# EAGLE schematic FiberLink_RS232 (EAGLE 6.4)
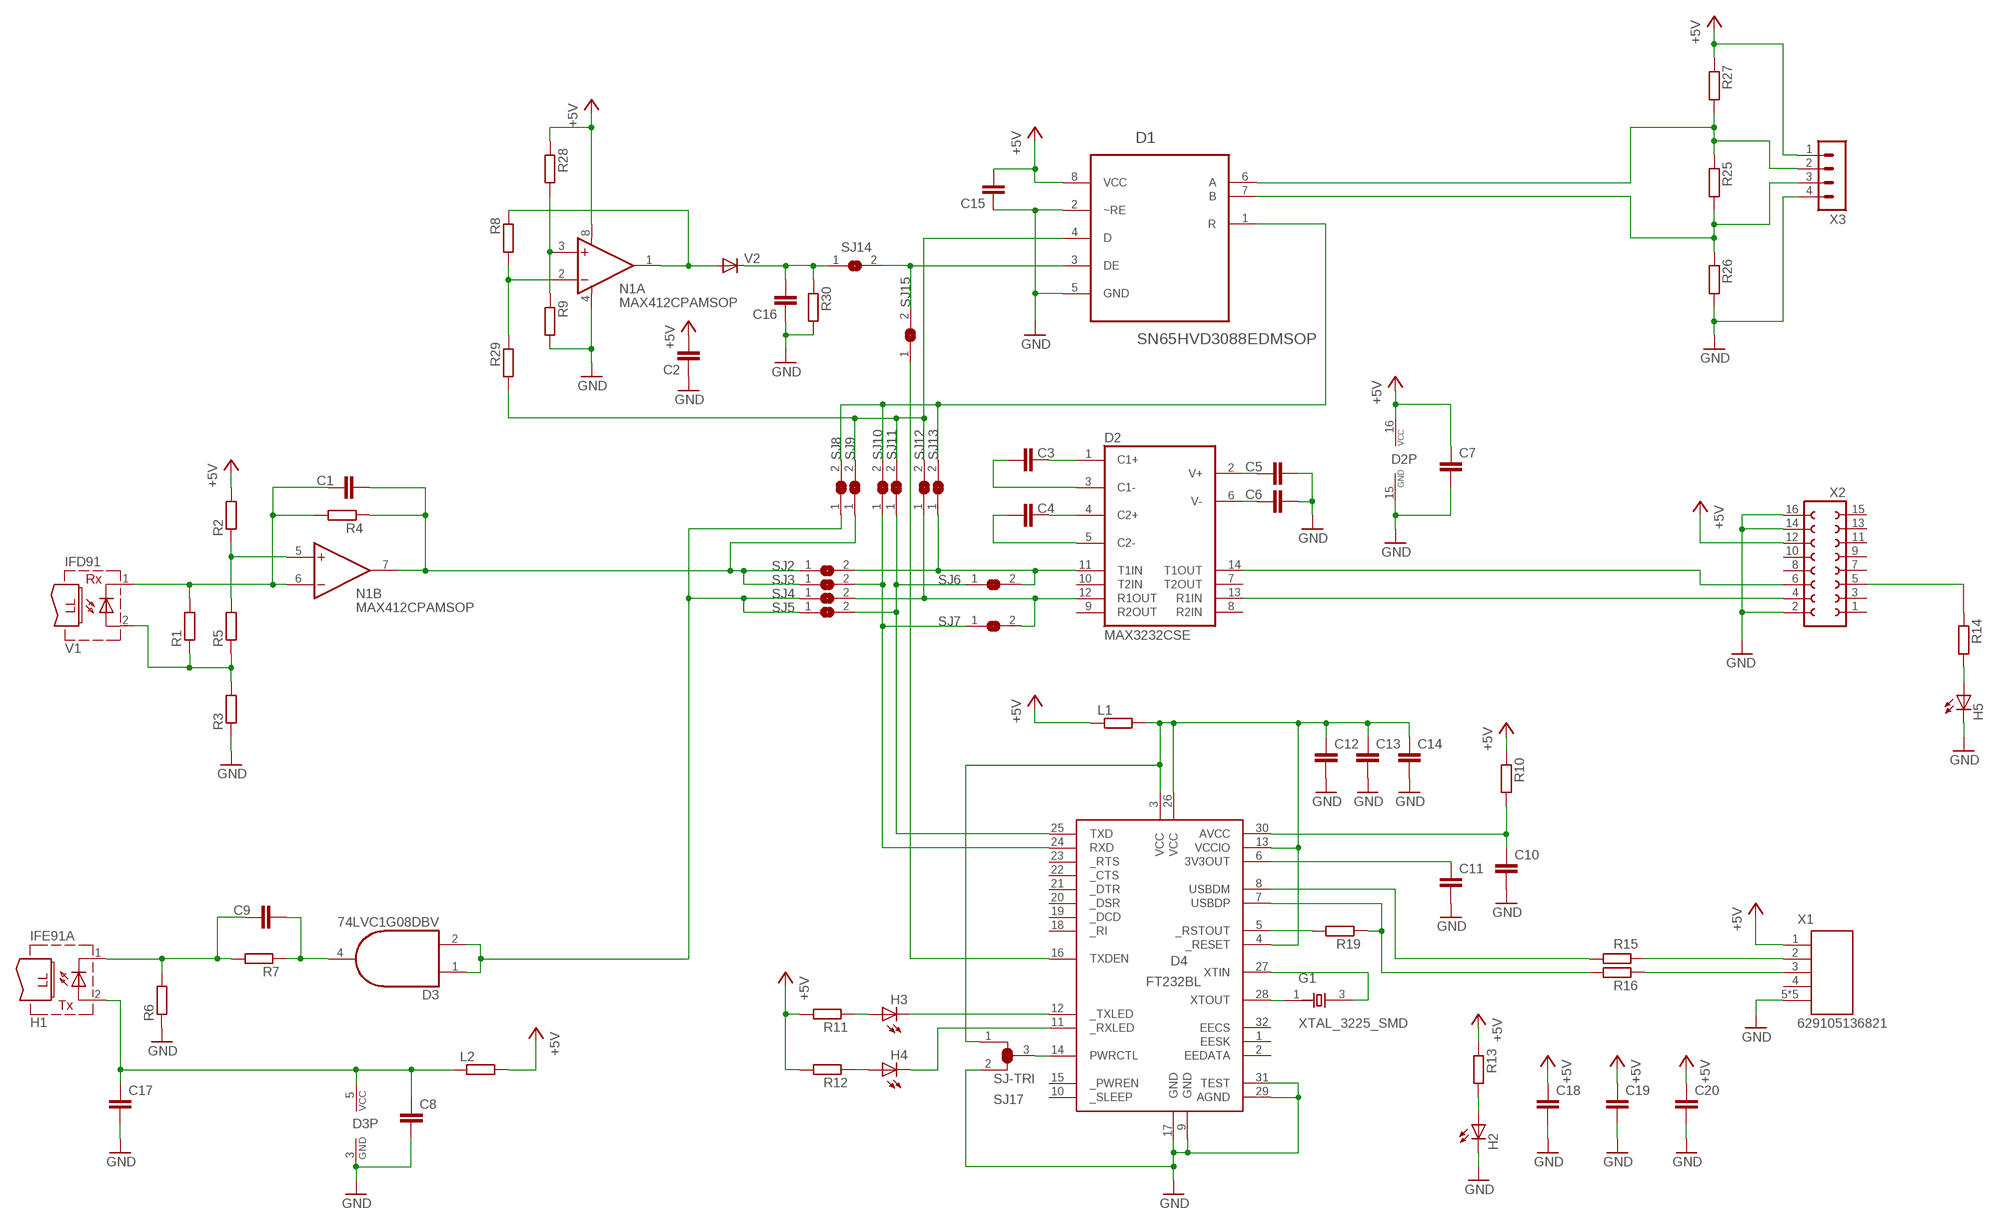
[diagram p0: schematic, sheet 1]

## Parts
C1  C-EUC0402  [C0402]
C2  C-EUC0402  [C0402]
C3  C-EUC0402  [C0402]
C4  C-EUC0402  [C0402]
C5  C-EUC0402  [C0402]
C6  C-EUC0402  [C0402]
C7  C-EUC0402  [C0402]
C8  C-EUC0402  [C0402]
C9  C-EUC0402  [C0402]
C10  C-EUC0402  [C0402]
C11  C-EUC0402  [C0402]
C12  C-EUC0402  [C0402]
C13  C-EUC0402  [C0402]
C14  C-EUC0402  [C0402]
C15  C-EUC0402  [C0402]
C16  C-EUC0402  [C0402]
C17  C-EUC0402  [C0402]
C18  C-EUC0805  [C0805]
C19  C-EUC0805  [C0805]
C20  C-EUC0805  [C0805]
D1  SN65HVD3088EDMSOP  [SOP65P490X110-8N]
D2  MAX3232CSE  [SO16]
D3  74LVC1G08DBV  [SOT23-5]
D4  FT232BL  [LQFP32]
G1  XTAL_3225_SMD  [X_3225]
H1  IFE91A  [IFO-IFX]
H2  LEDCHIP-LED0603  [CHIP-LED0603]
H3  LEDCHIP-LED0603  [CHIP-LED0603]
H4  LEDCHIP-LED0603  [CHIP-LED0603]
H5  LEDCHIP-LED0603  [CHIP-LED0603]
L1  R-EU_R0402  [R0402_VISHAY]
L2  R-EU_R0402  [R0402_VISHAY]
N1  MAX412CPAMSOP  [SOP65P490X110-8N]
R1  R-EU_R0402  [R0402_VISHAY]
R2  R-EU_R0402  [R0402_VISHAY]
R3  R-EU_R0402  [R0402_VISHAY]
R4  R-EU_R0402  [R0402_VISHAY]
R5  R-EU_R0402  [R0402_VISHAY]
R6  R-EU_R1206  [R1206]
R7  R-EU_R1206  [R1206]
R8  R-EU_R0402  [R0402_VISHAY]
R9  R-EU_R0402  [R0402_VISHAY]
R10  R-EU_R0402  [R0402_VISHAY]
R11  R-EU_R0402  [R0402_VISHAY]
R12  R-EU_R0402  [R0402_VISHAY]
R13  R-EU_R0402  [R0402_VISHAY]
R14  R-EU_R0402  [R0402_VISHAY]
R15  R-EU_R0402  [R0402_VISHAY]
R16  R-EU_R0402  [R0402_VISHAY]
R19  R-EU_R0402  [R0402_VISHAY]
R25  R-EU_R1206  [R1206]
R26  R-EU_R0603  [R0603]
R27  R-EU_R0603  [R0603]
R28  R-EU_R0402  [R0402_VISHAY]
R29  R-EU_R0402  [R0402_VISHAY]
R30  R-EU_R0402  [R0402_VISHAY]
SJ2  SJ  [SJ-SMALL]
SJ3  SJ  [SJ-SMALL]
SJ4  SJ  [SJ-SMALL]
SJ5  SJ  [SJ-SMALL]
SJ6  SJ  [SJ-SMALL]
SJ7  SJ  [SJ-SMALL]
SJ8  SJ  [SJ-SMALL]
SJ9  SJ  [SJ-SMALL]
SJ10  SJ  [SJ-SMALL]
SJ11  SJ  [SJ-SMALL]
SJ12  SJ  [SJ-SMALL]
SJ13  SJ  [SJ-SMALL]
SJ14  SJ  [SJ-SMALL]
SJ15  SJ  [SJ-SMALL]
SJ17  SJ-TRI  [SJ-SMALL-TRI]
V1  IFD91  [IFO-IFX]
V2  DIODE-SOD323-R  [SOD323-R]
X1  629105136821  [629105136821]
X2  FE08-2  [FE08-2]
X3  MA04-1  [MA04-1]

## Nets
485_HIGH: D1.6(A) R25.1 R27.2 X3.2
485_LOW: D1.7(B) R25.2 R26.1 X3.3
+5V: C2.2 C7.1 C15.2 C18.1 C19.1 C20.1 D1.8(VCC) D2.16(VCC) L1.1 L2.2 N1.8(A:V+) R2.2 R10.1 R11.2 R12.2 R13.1 R27.1 R28.1 X1.1 X2.12 X3.1
AVCC: C10.1 D4.30(AVCC) R10.2
CARRIER_SENSE: C16.2 R30.1 SJ14.1 V2.C
FPGADONE: R14.1 X2.5
G1: D4.27(XTIN) G1.3(X2)
GND: C2.1 C5.2 C6.2 C7.2 C8.2 C10.2 C11.2 C12.2 C13.2 C14.2 C15.1 C16.1 C17.2 C18.2 C19.2 C20.2 D1.2(~RE) D1.5(GND) D2.15(GND) D3.3(GND) D4.9(GND) D4.17(GND) D4.29(AGND) D4.31(TEST) H2.C H5.C N1.4(A:V-) R3.1 R6.1 R9.2 R26.2 R30.2 SJ17.2 X1.5 X1.Z1 X1.Z2 X1.Z3 X1.Z4 X2.2 X2.14 X2.16 X3.4
N$1: C1.1 N1.6(B:-IN) R1.2 R4.2 V1.1(C)
N$2: N1.1(A:OUT) R8.1 V2.A
N$3: R1.1 R3.2 R5.1 V1.2(A)
N$4: D4.12(_TXLED) H3.C
N$5: N1.5(B:+IN) R2.1 R5.2
N$6: C4.2 D2.5(C2-)
N$7: C4.1 D2.4(C2+)
N$8: C3.2 D2.3(C1-)
N$9: C3.1 D2.1(C1+)
N$10: C6.1 D2.6(V-)
N$11: C5.1 D2.2(V+)
N$12: D2.14(T1OUT) X2.6
N$13: D2.13(R1IN) X2.4
N$14: D4.11(_RXLED) H4.C
N$15: C9.1 H1.1(C) R6.2 R7.2
N$16: N1.3(A:+IN) R9.1 R28.2
N$17: C9.2 D3.4(O) R7.1
N$18: H3.A R11.1
N$19: R15.1 X1.2
N$20: H4.A R12.1
N$21: D4.8(USBDM) R15.2
N$22: H2.A R13.2
N$23: D4.7(USBDP) R16.2 R19.1
N$24: R16.1 X1.3
N$25: H5.A R14.2
N$26: D4.14(PWRCTL) SJ17.3
N$29: D4.5(_RSTOUT) R19.2
N$32: N1.2(A:-IN) R8.2 R29.1
N$33: D4.28(XTOUT) G1.1(X1)
RXD_232: D2.12(R1OUT) SJ4.2 SJ7.2 SJ12.1
RXD_485: D1.1(R) SJ8.2 SJ10.2 SJ13.2
RXD_FIBER: C1.2 N1.7(B:OUT) R4.1 SJ2.1 SJ3.1 SJ9.1
RXD_USB: D4.24(RXD) SJ3.2 SJ7.1 SJ10.1
TX_VCC: C8.1 C17.1 D3.5(VCC) H1.2(A) L2.1
TXD_232: D2.11(T1IN) SJ2.2 SJ6.2 SJ13.1
TXD_485: D1.4(D) R29.2 SJ9.2 SJ11.2 SJ12.2
TXD_FIBER: D3.1(I0) D3.2(I1) SJ4.1 SJ5.1 SJ8.1
TXD_USB: D4.25(TXD) SJ5.2 SJ6.1 SJ11.1
TXEN_485: D1.3(DE) SJ14.2 SJ15.2
TXEN_USB: D4.16(TXDEN) SJ15.1
USB3V3: C11.1 D4.6(3V3OUT)
USBVCC: C12.1 C13.1 C14.1 D4.3(VCC) D4.4(_RESET) D4.13(VCCIO) D4.26(VCC) L1.2 SJ17.1
Unconnected: D2.7(T2OUT) D2.8(R2IN) D2.9(R2OUT) D2.10(T2IN) D4.1(EESK) D4.2(EEDATA) D4.10(_SLEEP) D4.15(_PWREN) D4.18(_RI) D4.19(_DCD) D4.20(_DSR) D4.21(_DTR) D4.22(_CTS) D4.23(_RTS) D4.32(EECS) X1.4 X2.1 X2.3 X2.7 X2.8 X2.9 X2.10 X2.11 X2.13 X2.15

## Library data of the parts
C1-C20 = rcl:C-EU: CAPACITOR, European symbol
D1 = OMAT_IC:SN65HVD3088ED: Low-Power RS-485 Transceivers, Available in a Small MSOP-8 Package
D2 = maxim:MAX3232*: True RS-232 Transceivers 3.0V to 5.5V, Low-Power up to 1Mbps, Using Four 0.1µF External Capacitors Source: http://pdfserv.maxim-ic.com/en/ds/MAX3222-MAX3241.pdf; MPN: MAX3232CSE; OC_FARNELL: 9725490; OC_NEWARK: 90C2890
D3 = 74xx-little-us:74*1G08: 2-input AND gate
D4 = ftdichip-3:FT232BL: USB UART 2nd Generation USB UART (USB <-> Serial) Controller
G1 = OMAT_IC:XTAL_3225_SMD: CRYSTAL CLOCK OSCILLATORS 5.0 Vdc or 3.3 Vdc - LOW PROFILE ULTRA MINIATURE CERAMIC SURFACE MOUNT Source: http://www.abracon.com/Oscillators/asf1-L-L1.pdf
H1 = OMAT_IC:IFE91A
H2-H5 = OMAT_IC:LED: LED OSRAM: - CHIPLED LG R971, LG N971, LY N971, LG Q971, LY Q971, LO R971, LY R971 LH N974, LH R974 LS Q976, LO Q976, LY Q976 LO Q996 - Hyper CHIPLED LW Q18S LB Q993, LB Q99A, LB R99A - SideLED LS A670, LO A670, LY A670, LG A670, LP A670 LB A673, LV A673, LT A673, LW A673 LH A674 LY A675 LS A676, LA A676, LO A676, LY A676, LW A676 LS A679, LY A679, LG A679 - Hyper Micro SIDELED® LS Y876, LA Y876, LO Y876, LY Y876 LT Y87S - SmartLED LW L88C, LW L88S LB L89C, LB L89S, LG L890 LS L89K, LO L89K, LY L89K LS L896, LA L896, LO L896, LY L896 - TOPLED LS T670, LO T670, LY T670, LG T670, LP T670 LSG T670, LSP T670, LSY T670, LOP T670, LYG T670 LG T671, LOG T671, LSG T671 LB T673, LV T673, LT T673, LW T673 LH T674 LS T676, LA T676, LO T676, LY T676, LB T676, LH T676, LSB T676, LW T676 LB T67C, LV T67C, LT T67C, LS T67K, LO T67K, LY T67K, LW E67C LS E67B, LA E67B, LO E67B, LY E67B, LB E67C, LV E67C, LT E67C LW T67C LS T679, LY T679, LG T679 LS T770, LO T770, LY T770, LG T770, LP T770 LB T773, LV T773, LT T773, LW T773 LH T774 LS E675, LA E675, LY E675, LS T675 LS T776, LA T776, LO T776, LY T776, LB T776 LHGB T686 LT T68C, LB T68C - Hyper Mini TOPLED® LB M676 - Mini TOPLED Santana® LG M470 LS M47K, LO M47K, LY M47K Source: http://www.osram.convergy.de LUXEON: - LUMILED® LXK2-PW12-R00, LXK2-PW12-S00, LXK2-PW14-U00, LXK2-PW14-V00 LXK2-PM12-R00, LXK2-PM12-S00, LXK2-PM14-U00 LXK2-PE12-Q00, LXK2-PE12-R00, LXK2-PE12-S00, LXK2-PE14-T00, LXK2-PE14-U00 LXK2-PB12-K00, LXK2-PB12-L00, LXK2-PB12-M00, LXK2-PB14-N00, LXK2-PB14-P00, LXK2-PB14-Q00 LXK2-PR12-L00, LXK2-PR12-M00, LXK2-PR14-Q00, LXK2-PR14-R00 LXK2-PD12-Q00, LXK2-PD12-R00, LXK2-PD12-S00 LXK2-PH12-R00, LXK2-PH12-S00 LXK2-PL12-P00, LXK2-PL12-Q00, LXK2-PL12-R00 Source: www.luxeon.com KINGBRIGHT: KA-3528ASYC Source: www.kingbright.com
L1 L2 R1-R16 R19 R25-R30 = rcl:R-EU_: RESISTOR, European symbol
N1 = OMAT_IC:MAX412CPA: OP AMP
SJ2-SJ15 = OMAT_IC:SJ: SMD solder JUMPER
SJ17 = OMAT_IC:SJ-TRI
V1 = OMAT_IC:IFD91
V2 = diode:DIODE-: DIODE
X1 = OMAT_IC:629105136821: WR-COM SMT Horizontal 5 Contacts Micro USB Type B,5 pins
X2 = OMAT_IC:FE08-2: FEMALE HEADER; OC_FARNELL: unknown; OC_NEWARK: unknown
X3 = OMAT_IC:MA04-1: PIN HEADER; OC_FARNELL: unknown; OC_NEWARK: unknown